# EAGLE design controler (EAGLE 6.4)
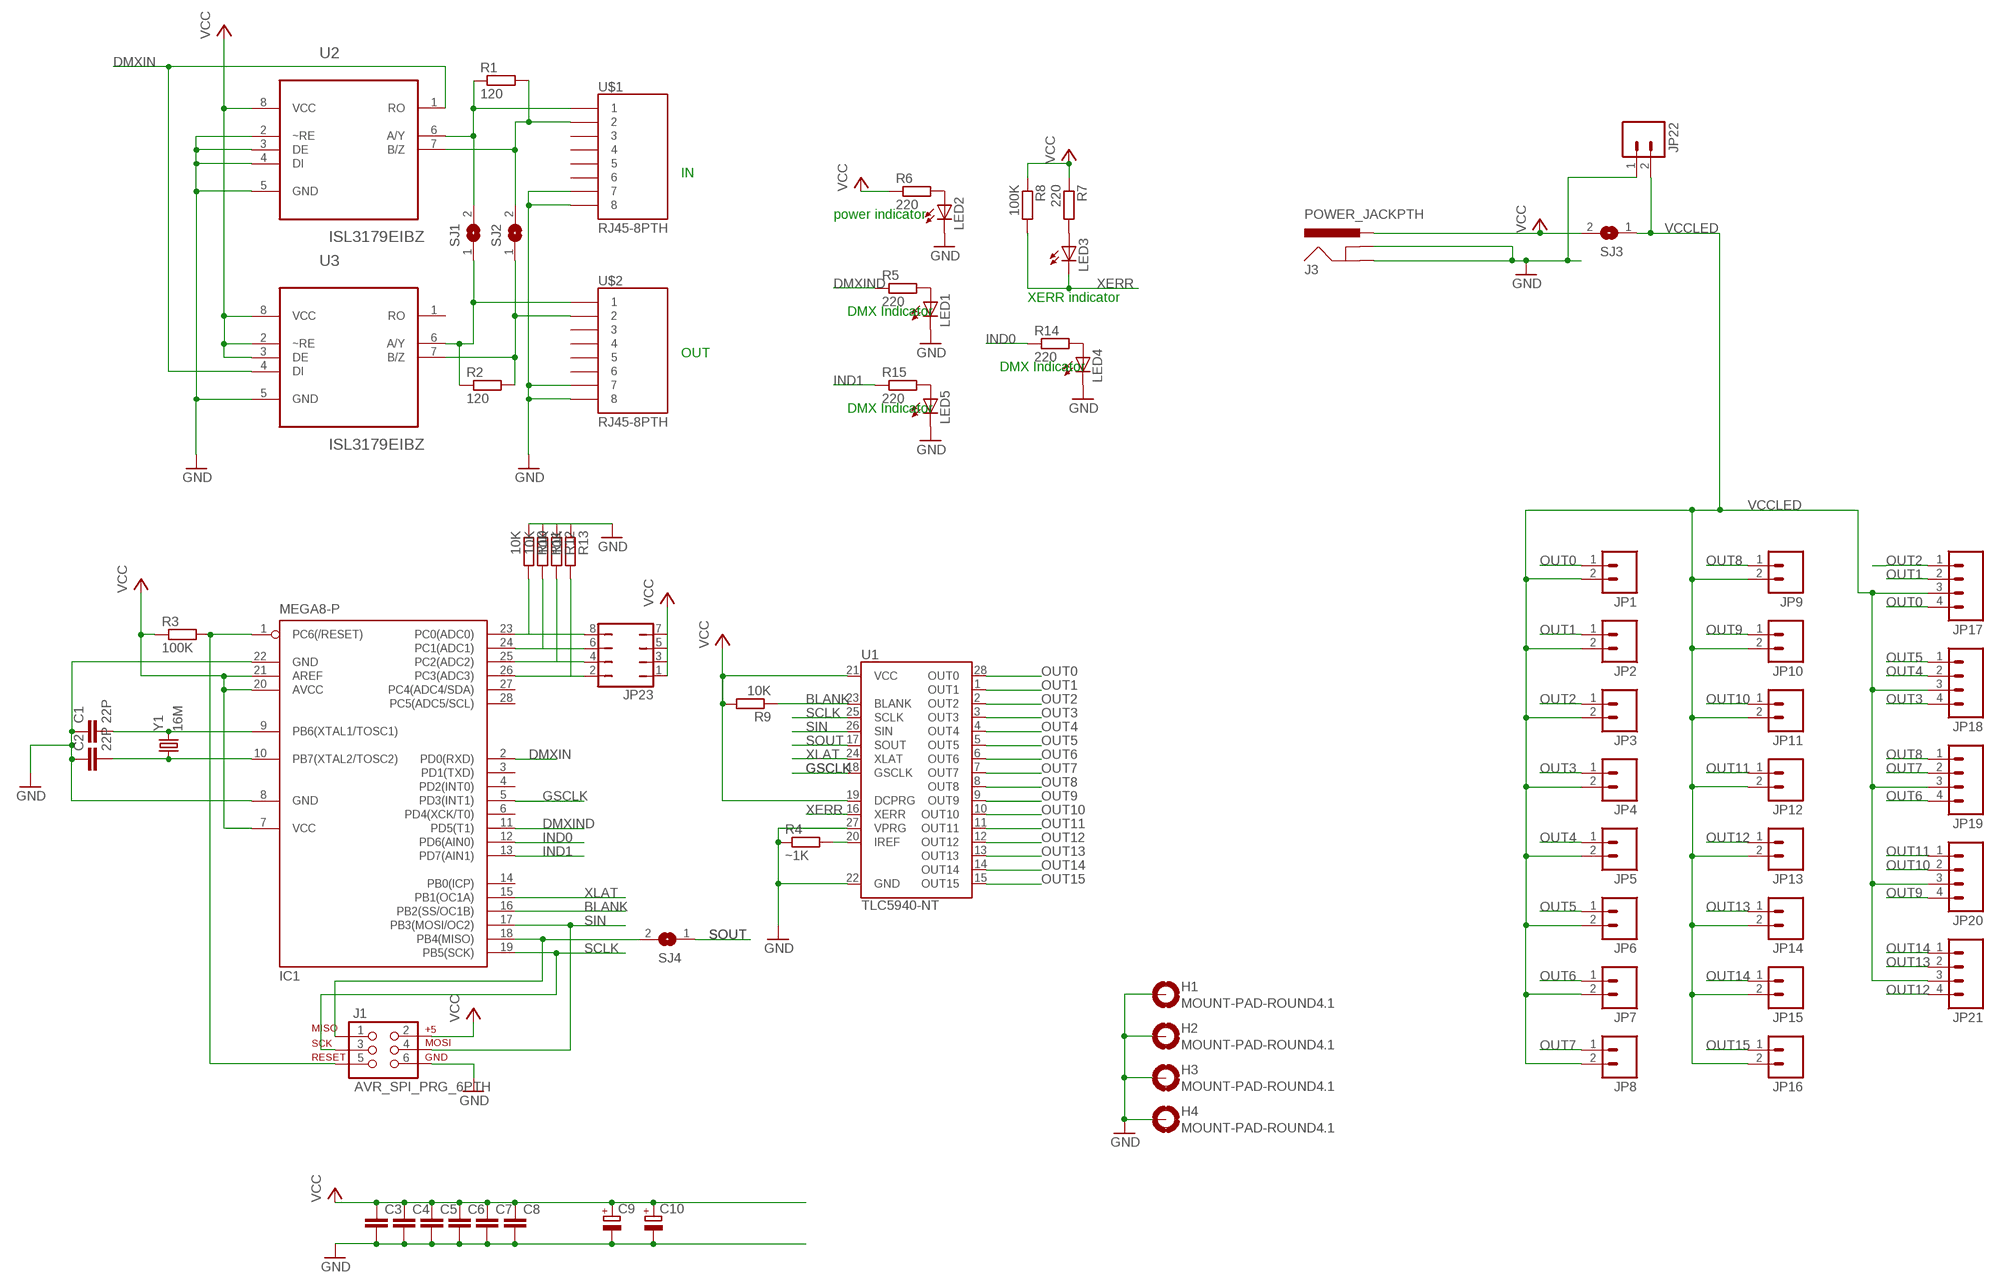
[diagram p0: schematic, sheet 1]

## Parts
C1  22P  C-EUC0603  [C0603]
C2  22P  C-EUC0603  [C0603]
C3  C-EUC0603  [C0603]
C4  C-EUC0603  [C0603]
C5  C-EUC0603  [C0603]
C6  C-EUC0603  [C0603]
C7  C-EUC0603  [C0603]
C8  C-EUC0603  [C0603]
C9  CPOL-EUE2.5-6  [E2,5-6]
C10  CPOL-EUE3.5-10  [E3,5-10]
H1  MOUNT-PAD-ROUND4.1  [4,1-PAD]
H2  MOUNT-PAD-ROUND4.1  [4,1-PAD]
H3  MOUNT-PAD-ROUND4.1  [4,1-PAD]
H4  MOUNT-PAD-ROUND4.1  [4,1-PAD]
IC1  MEGA8-P  [DIL28-3]
J1  AVR_SPI_PRG_6PTH  [2X3]
J3  POWER_JACKPTH  [POWER_JACK_PTH]
JP1  M02POLAR  [MOLEX-1X2]
JP2  M02POLAR  [MOLEX-1X2]
JP3  M02POLAR  [MOLEX-1X2]
JP4  M02POLAR  [MOLEX-1X2]
JP5  M02POLAR  [MOLEX-1X2]
JP6  M02POLAR  [MOLEX-1X2]
JP7  M02POLAR  [MOLEX-1X2]
JP8  M02POLAR  [MOLEX-1X2]
JP9  M02POLAR  [MOLEX-1X2]
JP10  M02POLAR  [MOLEX-1X2]
JP11  M02POLAR  [MOLEX-1X2]
JP12  M02POLAR  [MOLEX-1X2]
JP13  M02POLAR  [MOLEX-1X2]
JP14  M02POLAR  [MOLEX-1X2]
JP15  M02POLAR  [MOLEX-1X2]
JP16  M02POLAR  [MOLEX-1X2]
JP17  M04POLAR  [MOLEX-1X4]
JP18  M04POLAR  [MOLEX-1X4]
JP19  M04POLAR  [MOLEX-1X4]
JP20  M04POLAR  [MOLEX-1X4]
JP21  M04POLAR  [MOLEX-1X4]
JP22  M023.5MM  [SCREWTERMINAL-3.5MM-2]
JP23  JP4Q  [JP4Q]
LED1  LEDCHIPLED_0603  [CHIPLED_0603]
LED2  LEDCHIPLED_0603  [CHIPLED_0603]
LED3  LEDCHIPLED_0603  [CHIPLED_0603]
LED4  LEDCHIPLED_0603  [CHIPLED_0603]
LED5  LEDCHIPLED_0603  [CHIPLED_0603]
R1  120  R-EU_R0603  [R0603]
R2  120  R-EU_R0603  [R0603]
R3  100K  R-EU_R0603  [R0603]
R4  ~1K  R-EU_R0603  [R0603]
R5  220  R-EU_R0603  [R0603]
R6  220  R-EU_R0603  [R0603]
R7  220  R-EU_R0603  [R0603]
R8  100K  R-EU_R0603  [R0603]
R9  10K  R-EU_R0603  [R0603]
R10  10K  R-EU_R0603  [R0603]
R11  10K  R-EU_R0603  [R0603]
R12  10K  R-EU_R0603  [R0603]
R13  10K  R-EU_R0603  [R0603]
R14  220  R-EU_R0603  [R0603]
R15  220  R-EU_R0603  [R0603]
SJ1  SJ  [SJ]
SJ2  SJ  [SJ]
SJ3  SJW  [SJW]
SJ4  SJ  [SJ]
U1  TLC5940-NT  [DIL28-3]
U2  ISL3179EIBZ  [SOIC127P600X175-8N]
U3  ISL3179EIBZ  [SOIC127P600X175-8N]
U$1  RJ45-8PTH  [RJ45-8]
U$2  RJ45-8PTH  [RJ45-8]
Y1  16M  CRYSTALHC49US  [HC49US]

## Nets
BLANK: IC1.16(PB2(SS/OC1B)) R9.1 U1.23(BLANK)
DMXIN: IC1.2(PD0(RXD)) U2.1(RO) U3.4(DI)
DMXIND: IC1.11(PD5(T1)) R5.1
GND: C1.1 C2.1 C3.2 C4.2 C5.2 C6.2 C7.2 C8.2 C9.- C10.- H1.B4,1(MOUNT) H2.B4,1(MOUNT) H3.B4,1(MOUNT) H4.B4,1(MOUNT) IC1.8(GND) IC1.22(GND) J1.6 J3.GND J3.GNDBREAK JP22.1 LED1.C LED2.C LED4.C LED5.C R4.1 R10.1 R11.1 R12.1 R13.1 U1.22(GND) U1.27(VPRG) U2.2(~RE) U2.3(DE) U2.4(DI) U2.5(GND) U3.5(GND) U$1.7 U$1.8 U$2.7 U$2.8
GSCLK: IC1.5(PD3(INT1)) U1.18(GSCLK)
IND0: IC1.12(PD6(AIN0)) R14.1
IND1: IC1.13(PD7(AIN1)) R15.1
N$1: R1.1 SJ1.2 U2.6(A/Y) U$1.1
N$2: R1.2 SJ2.2 U2.7(B/Z) U$1.2
N$3: R2.1 SJ1.1 U3.6(A/Y) U$2.1
N$4: R2.2 SJ2.1 U3.7(B/Z) U$2.2
N$5: C1.2 IC1.9(PB6(XTAL1/TOSC1)) Y1.2
N$6: C2.2 IC1.10(PB7(XTAL2/TOSC2)) Y1.1
N$7: IC1.23(PC0(ADC0)) JP23.8 R10.2
N$8: IC1.24(PC1(ADC1)) JP23.6 R11.2
N$9: IC1.1(PC6(/RESET)) J1.5 R3.2
N$10: IC1.25(PC2(ADC2)) JP23.4 R12.2
N$11: IC1.18(PB4(MISO)) J1.1 SJ4.2
N$12: IC1.26(PC3(ADC3)) JP23.2 R13.2
N$13: LED5.A R15.2
N$14: R4.2 U1.20(IREF)
N$15: LED3.A R7.2
N$17: LED1.A R5.2
N$18: LED4.A R14.2
N$19: LED2.A R6.2
OUT0: JP1.1 JP17.4 U1.28(OUT0)
OUT1: JP2.1 JP17.2 U1.1(OUT1)
OUT2: JP3.1 JP17.1 U1.2(OUT2)
OUT3: JP4.1 JP18.4 U1.3(OUT3)
OUT4: JP5.1 JP18.2 U1.4(OUT4)
OUT5: JP6.1 JP18.1 U1.5(OUT5)
OUT6: JP7.1 JP19.4 U1.6(OUT6)
OUT7: JP8.1 JP19.2 U1.7(OUT7)
OUT8: JP9.1 JP19.1 U1.8(OUT8)
OUT9: JP10.1 JP20.4 U1.9(OUT9)
OUT10: JP11.1 JP20.2 U1.10(OUT10)
OUT11: JP12.1 JP20.1 U1.11(OUT11)
OUT12: JP13.1 JP21.4 U1.12(OUT12)
OUT13: JP14.1 JP21.2 U1.13(OUT13)
OUT14: JP15.1 JP21.1 U1.14(OUT14)
OUT15: JP16.1 U1.15(OUT15)
SCLK: IC1.19(PB5(SCK)) J1.3 U1.25(SCLK)
SIN: IC1.17(PB3(MOSI/OC2)) J1.4 U1.26(SIN)
SOUT: SJ4.1 U1.17(SOUT)
VCC: C3.1 C4.1 C5.1 C6.1 C7.1 C8.1 C9.+ C10.+ IC1.7(VCC) IC1.20(AVCC) IC1.21(AREF) J1.2 J3.PWR JP23.1 JP23.3 JP23.5 JP23.7 R3.1 R6.1 R7.1 R8.1 R9.2 SJ3.2 U1.19(DCPRG) U1.21(VCC) U2.8(VCC) U3.2(~RE) U3.3(DE) U3.8(VCC)
VCCLED: JP1.2 JP2.2 JP3.2 JP4.2 JP5.2 JP6.2 JP7.2 JP8.2 JP9.2 JP10.2 JP11.2 JP12.2 JP13.2 JP14.2 JP15.2 JP16.2 JP17.3 JP18.3 JP19.3 JP20.3 JP21.3 JP22.2 SJ3.1
XERR: LED3.C R8.2 U1.16(XERR)
XLAT: IC1.15(PB1(OC1A)) U1.24(XLAT)
Unconnected: IC1.3(PD1(TXD)) IC1.4(PD2(INT0)) IC1.6(PD4(XCK/T0)) IC1.14(PB0(ICP)) IC1.27(PC4(ADC4/SDA)) IC1.28(PC5(ADC5/SCL)) U3.1(RO) U$1.3 U$1.4 U$1.5 U$1.6 U$2.3 U$2.4 U$2.5 U$2.6

## Notes on the sheet
- IN
- power indicator
- XERR indicator
- DMX Indicator
- OUT
- DMX Indicator
- DMX Indicator

## Library data of the parts
C1 C2 = rcl:C-EU: CAPACITOR, European symbol
C3-C8 = resistor:C-EU: CAPACITOR, European symbol
C9 C10 = resistor:CPOL-EU: POLARIZED CAPACITOR, European symbol
H1-H4 = holes:MOUNT-PAD-ROUND: MOUNTING PAD, round
IC1 = atmel:MEGA8-P: MICROCONTROLLER 8 Kbytes FLASH, 1 kbytes SRAM, 512 bytes EEPROM, USART, 4-channel 10 bit ADC, 2-channel 8 bit ADC Pin compatible with Atmega48, ATMega88, ATMega168 Source: avr.lbr; OC_FARNELL: unknown; OC_NEWARK: unknown
J1 = SparkFun:AVR_SPI_PRG_6: AVR ISP 6 Pin This is the reduced ISP connector for AVR programming. Common on Arduino. This footprint will take up less PCB space and can be used with a 10-pin to 6-pin adapter such as SKU: BOB-08508
J3 = SparkFun:POWER_JACK: Power Jack This is the standard 5.5mm barrel jack for power. The PTH is the most common, proven, reliable, footprint. All others are experimental. The Slot footprint only works if the mill layer is transmitted to the PCB fab house so be warned. Spark Fun Electronics SKU : PRT-00119. Mating wall wart : TOL-00298 (and others)
JP1-JP16 JP22 = SparkFun:M02: Header 2 Standard 2-pin 0.1" header. Use with straight break away headers (SKU : PRT-00116), right angle break away headers (PRT-00553), swiss pins (PRT-00743), machine pins (PRT-00117), and female headers (PRT-00115). Molex polarized connector foot print use with SKU : PRT-08233 with associated crimp pins and housings.
JP17-JP21 = SparkFun:M04: Header 4 Standard 4-pin 0.1" header. Use with straight break away headers (SKU : PRT-00116), right angle break away headers (PRT-00553), swiss pins (PRT-00743), machine pins (PRT-00117), and female headers (PRT-00115). Molex polarized connector foot print use with SKU : PRT-08231 with associated crimp pins and housings. 1MM SMD Version SKU: PRT-10208
JP23 = jumper:JP4Q: JUMPER
LED1-LED5 = adafruit:LED: LED OSRAM: - CHIPLED LG R971, LG N971, LY N971, LG Q971, LY Q971, LO R971, LY R971 LH N974, LH R974 LS Q976, LO Q976, LY Q976 LO Q996 - Hyper CHIPLED LW Q18S LB Q993, LB Q99A, LB R99A - SideLED LS A670, LO A670, LY A670, LG A670, LP A670 LB A673, LV A673, LT A673, LW A673 LH A674 LY A675 LS A676, LA A676, LO A676, LY A676, LW A676 LS A679, LY A679, LG A679 - Hyper Micro SIDELED® LS Y876, LA Y876, LO Y876, LY Y876 LT Y87S - SmartLED LW L88C, LW L88S LB L89C, LB L89S, LG L890 LS L89K, LO L89K, LY L89K LS L896, LA L896, LO L896, LY L896 - TOPLED LS T670, LO T670, LY T670, LG T670, LP T670 LSG T670, LSP T670, LSY T670, LOP T670, LYG T670 LG T671, LOG T671, LSG T671 LB T673, LV T673, LT T673, LW T673 LH T674 LS T676, LA T676, LO T676, LY T676, LB T676, LH T676, LSB T676, LW T676 LB T67C, LV T67C, LT T67C, LS T67K, LO T67K, LY T67K, LW E67C LS E67B, LA E67B, LO E67B, LY E67B, LB E67C, LV E67C, LT E67C LW T67C LS T679, LY T679, LG T679 LS T770, LO T770, LY T770, LG T770, LP T770 LB T773, LV T773, LT T773, LW T773 LH T774 LS E675, LA E675, LY E675, LS T675 LS T776, LA T776, LO T776, LY T776, LB T776 LHGB T686 LT T68C, LB T68C - Hyper Mini TOPLED® LB M676 - Mini TOPLED Santana® LG M470 LS M47K, LO M47K, LY M47K Source: http://www.osram.convergy.de/
R1 R2 = rcl:R-EU_: RESISTOR, European symbol
R3-R15 = resistor:R-EU_: RESISTOR, European symbol
SJ1-SJ4 = jumper:SJ: SMD solder JUMPER
U1 = SparkFun:TLC5940: TI TLC5940 16-channel LED Driver with Dot Correction and Grayscale PWM Control The TLC5940 is a 16-channel, constant-current sink LED driver. Each channel has an individually adjustable 4096-step grayscale PWM brightness control and a 64-step, constant-current sink (dot correction). The dot correction adjusts the brightness variations between LED channels and other LED drivers. The dot correction data is stored in an integrated EEPROM. Both grayscale control and dot correction are accessible via a serial interface. A single external resistor sets the maximum current value of all 16 channels. Packages: 28-pin HTSSOP 32-pin 5x5mm QFN 28-pin DIP
U2 U3 = glacsweb:ISL3179EIBZ: TRANCEIVER; MPN: ISL3179EIBZ; OC_FARNELL: 1439860; OC_NEWARK: 58M7513; PACKAGE: SOIC-8; SUPPLIER: Intersil
U$1 U$2 = SparkFun:RJ45-8: RJ45 Jack Simple RJ45, 8-pin connection - connector for common Cat5, Cat5e, and Cat6 Ethernet cables. Footprint not yet proven in production. Connector sku is PRT-00643; Breakout PCB sku is BOB-00716.
Y1 = SparkFun:CRYSTAL: Crystals Various standard crystals. Proven footprints. Spark Fun Electronics SKU : COM-00534

## Board
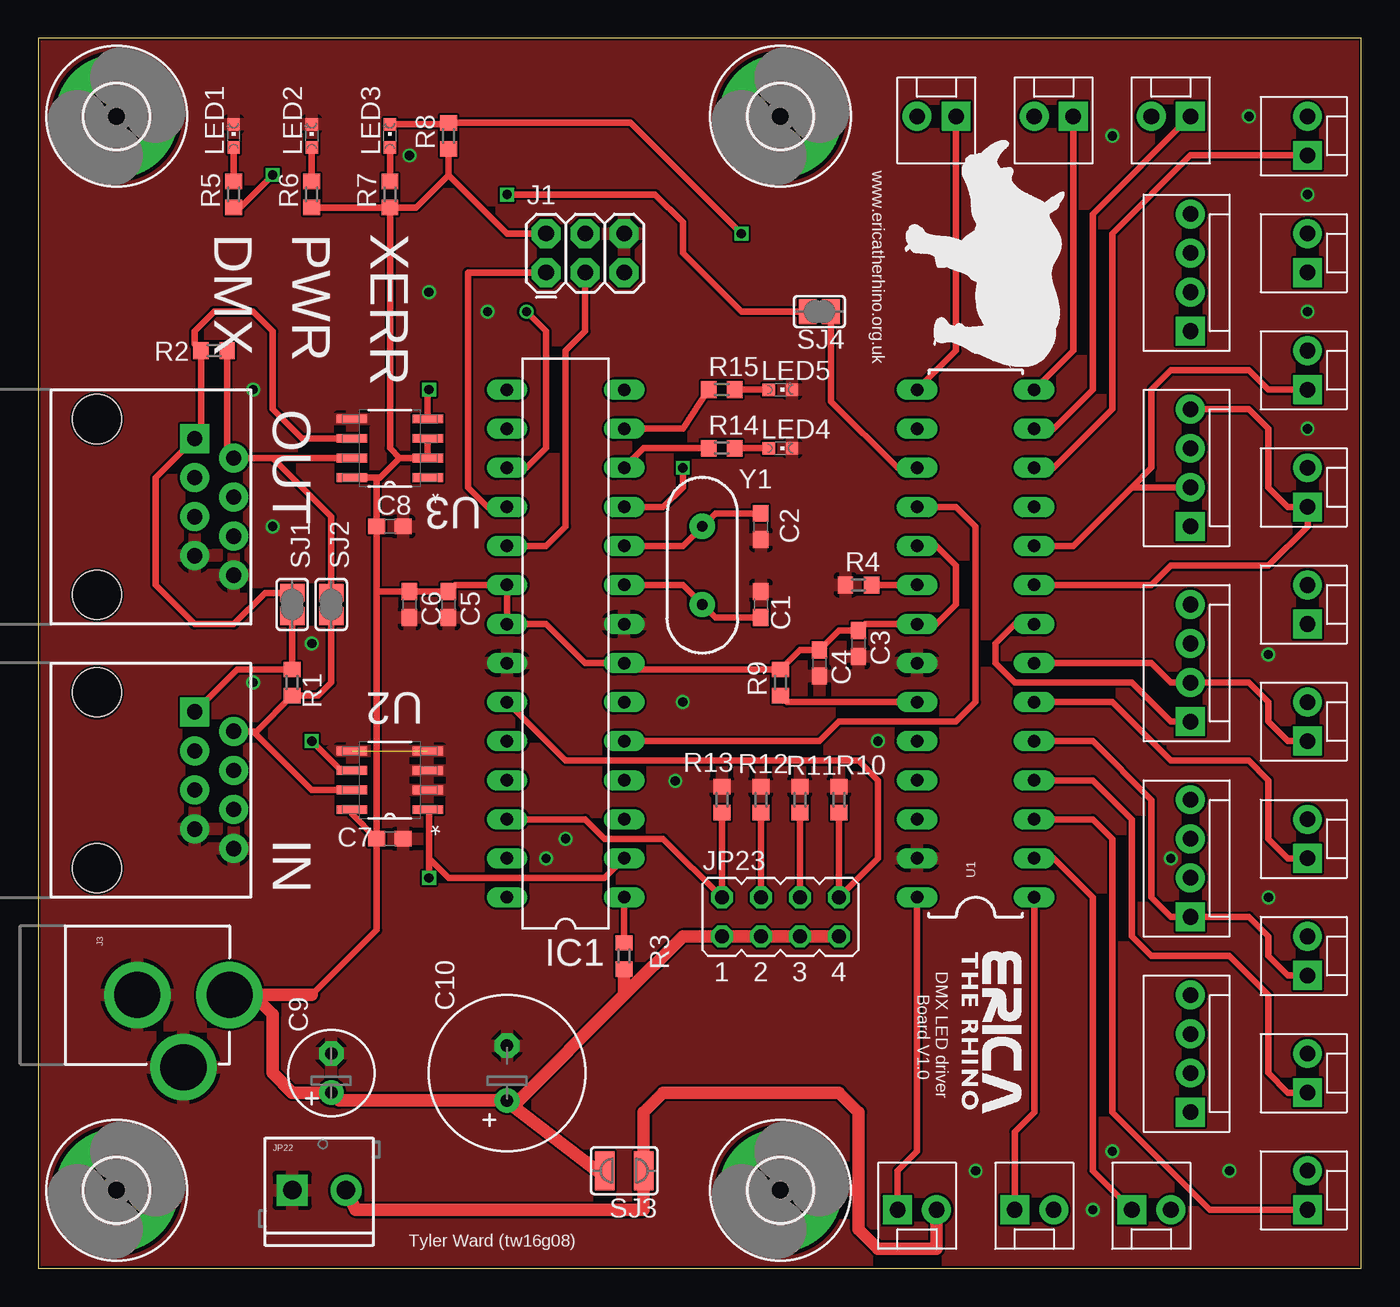
[diagram p1: board, top side]
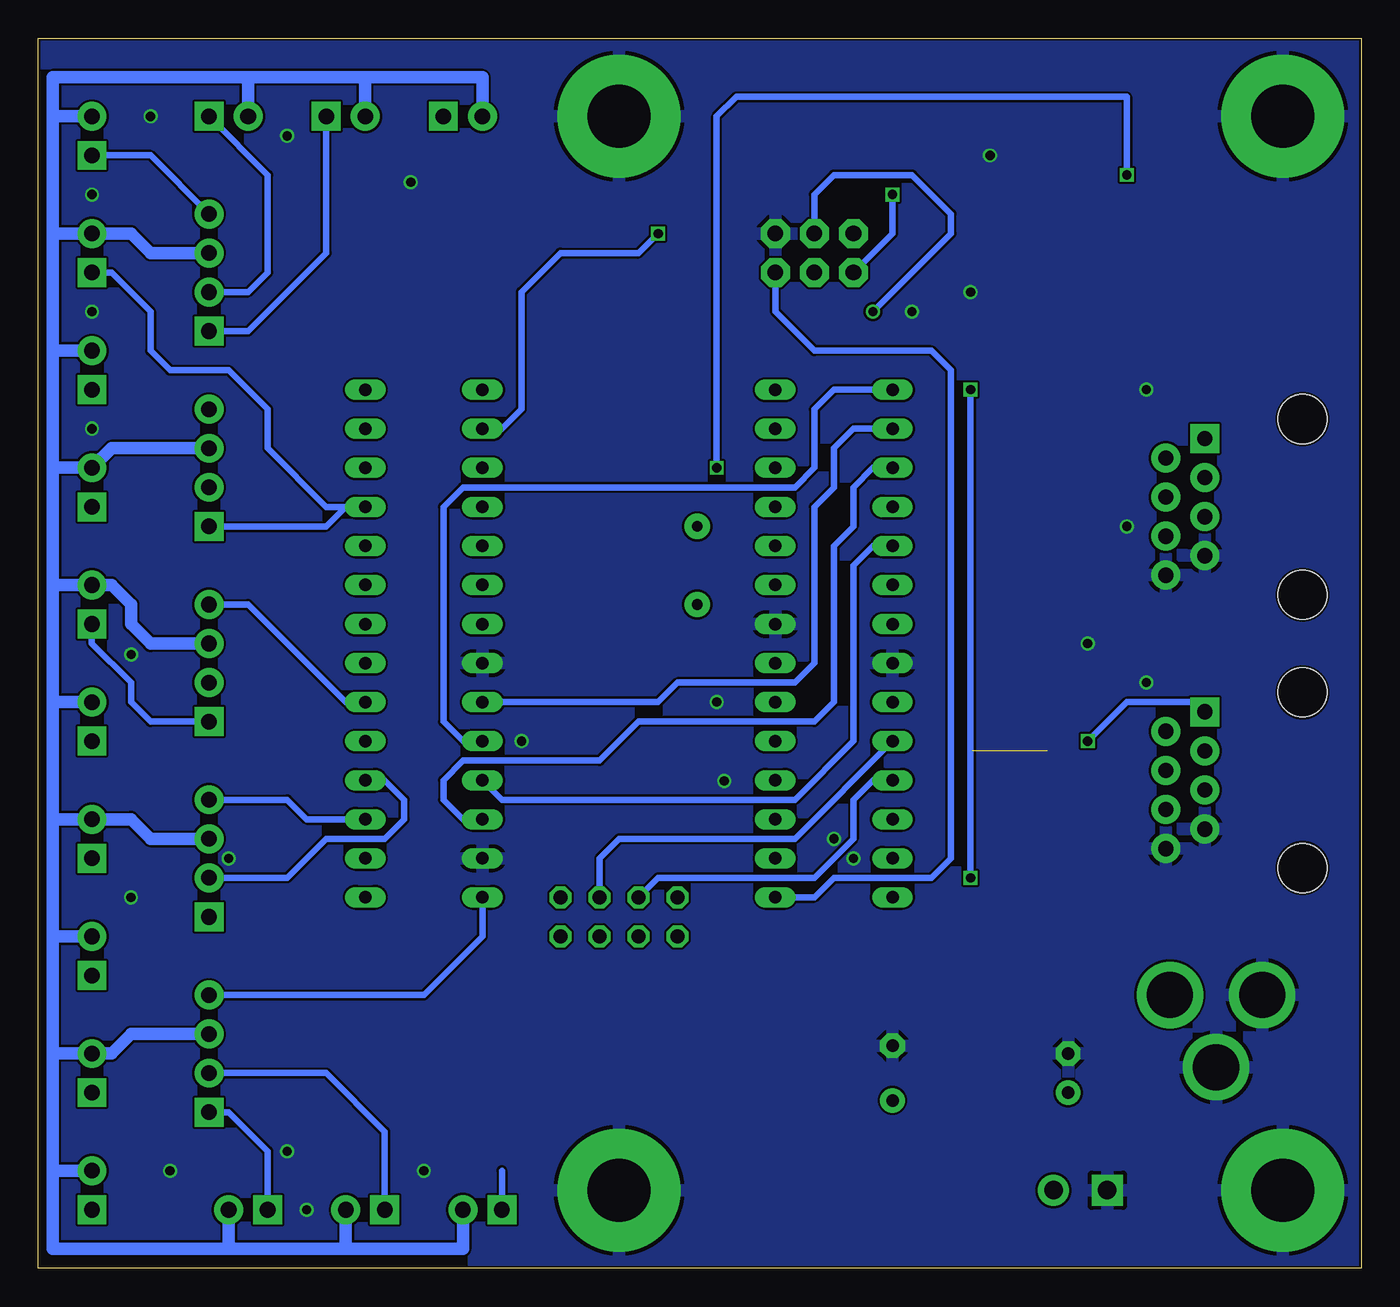
[diagram p2: board, bottom side, seen from below]

Size 86.03 x 80 mm. Coordinates in mm from the lower left corner, seen from the top.
Outline: 0,0 86.03,0 86.03,80 0,80 0,0
Copper layers (1*16): Top 0.035mm / dielectric 1.5mm / Bottom 0.035mm
Design rules "Hackvana": minimum track width 6mil, minimum drill 0.3mm, track to track 6mil, track to pad 6mil, pad to pad 6mil, via to via 6mil, smd to smd 0mil, copper to edge 6mil, drill to drill 6mil, minimum pad ring 10mil, minimum via ring 6mil, stop-mask expansion 2mil, vias tented up to drill 100mil, thermal gap 10mil

### Footprints (pad centres in the part's own frame; a part is rotated, then mirrored left to right if it is on the bottom)
C0603 = smd 1.1 x 1: 1 -0.85,0; 2 0.85,0
E2,5-6 = drill 0.813 pad 1.6: + -1.27,0 | drill 0.813 pad 1.6 octagon: - 1.27,0
E3,5-10 = drill 0.813 pad 1.6: + -1.778,0 | drill 0.813 pad 1.6 octagon: - 1.778,0
4,1-PAD = drill 4.1 pad 8: B4,1 0,0
DIL28-3 = drill 0.813 long: 1 -16.51,-3.81; 2 -13.97,-3.81; 3 -11.43,-3.81; 4 -8.89,-3.81; 5 -6.35,-3.81; 6 -3.81,-3.81; 7 -1.27,-3.81; 8 1.27,-3.81; 9 3.81,-3.81; 10 6.35,-3.81; 11 8.89,-3.81; 12 11.43,-3.81; 13 13.97,-3.81; 14 16.51,-3.81; 15 16.51,3.81; 16 13.97,3.81; 17 11.43,3.81; 18 8.89,3.81; 19 6.35,3.81; 20 3.81,3.81; 21 1.27,3.81; 22 -1.27,3.81; 23 -3.81,3.81; 24 -6.35,3.81; 25 -8.89,3.81; 26 -11.43,3.81; 27 -13.97,3.81; 28 -16.51,3.81
2X3 = drill 1.016 pad 1.88 octagon: 1 0,0; 2 0,2.54; 3 2.54,0; 4 2.54,2.54; 5 5.08,0; 6 5.08,2.54
POWER_JACK_PTH = drill 2.997 pad 4.318: GND 0,7.7; GNDBREAK 4.7,10.7; PWR 0,13.7
MOLEX-1X2 = drill 1.016 pad 1.88 square: 1 0,0 | drill 1.016 pad 1.88: 2 2.54,0
MOLEX-1X4 = drill 1.016 pad 1.88 square: 1 0,0 | drill 1.016 pad 1.88: 2 2.54,0; 3 5.08,0; 4 7.62,0
SCREWTERMINAL-3.5MM-2 = drill 1.2 pad 2.032 square: 1 0,0 | drill 1.2 pad 2.032: 2 3.5,0
JP4Q = drill 0.914 octagon: 1 -3.81,-1.27; 2 -3.81,1.27; 3 -1.27,-1.27; 4 -1.27,1.27; 5 1.27,-1.27; 6 1.27,1.27; 7 3.81,-1.27; 8 3.81,1.27
CHIPLED_0603 = smd 0.8 x 0.8: A 0,-0.75; C 0,0.75
R0603 = smd 1 x 1.1: 1 -0.85,0; 2 0.85,0
SJ = smd 1.168 x 1.6: 1 -0.762,0; 2 0.762,0
SJW = smd 1.27 x 2.54: 1 -1.27,0; 2 1.27,0
SOIC127P600X175-8N = smd 1.981 x 0.559: 1 -2.464,1.905; 2 -2.464,0.635; 3 -2.464,-0.635; 4 -2.464,-1.905; 5 2.464,-1.905; 6 2.464,-0.635; 7 2.464,0.635; 8 2.464,1.905
RJ45-8 = drill 1 pad 1.88 square: 1 -4.445,6.35 | drill 1 pad 1.88: 2 -3.175,8.89; 3 -1.905,6.35; 4 -0.635,8.89; 5 0.635,6.35; 6 1.905,8.89; 7 3.175,6.35; 8 4.445,8.89 | hole 3.2: -5.715,0; 5.715,0
HC49US = drill 0.7 pad 1.651: 1 -2.54,0; 2 2.54,0

### Placement (x,y rotation side)
C1  46.99,43.18 270 top
C2  46.99,48.26 90 top
C3  53.34,40.64 270 top
C4  50.8,39.37 270 top
C5  26.67,43.18 270 top
C6  24.13,43.18 270 top
C7  22.86,27.94 0 top
C8  22.86,48.26 0 top
C9  19.05,12.7 90 top
C10  30.48,12.7 90 top
H1  5.08,5.08 0 top
H2  48.26,5.08 0 top
H3  48.26,74.93 0 top
H4  5.08,74.93 0 top
IC1  34.29,40.64 90 top
J1  33.02,64.77 0 top
J3  -1.27,17.78 270 top
JP1  55.88,3.81 0 top
JP2  63.5,3.81 0 top
JP3  71.12,3.81 0 top
JP4  82.55,3.81 90 top
JP5  82.55,11.43 90 top
JP6  82.55,19.05 90 top
JP7  82.55,26.67 90 top
JP8  82.55,34.29 90 top
JP9  82.55,41.91 90 top
JP10  82.55,49.53 90 top
JP11  82.55,57.15 90 top
JP12  82.55,64.77 90 top
JP13  82.55,72.39 90 top
JP14  74.93,74.93 180 top
JP15  67.31,74.93 180 top
JP16  59.69,74.93 180 top
JP17  74.93,10.16 90 top
JP18  74.93,22.86 90 top
JP19  74.93,35.56 90 top
JP20  74.93,48.26 90 top
JP21  74.93,60.96 90 top
JP22  16.51,5.08 0 top
JP23  48.26,22.86 0 top
LED1  12.7,73.66 0 top
LED2  17.78,73.66 0 top
LED3  22.86,73.66 0 top
LED4  48.26,53.34 270 top
LED5  48.26,57.15 270 top
R1  16.51,38.1 270 top
R2  11.43,59.69 0 top
R3  38.1,20.32 90 top
R4  53.34,44.45 0 top
R5  12.7,69.85 90 top
R6  17.78,69.85 90 top
R7  22.86,69.85 90 top
R8  26.67,73.66 90 top
R9  48.26,38.1 90 top
R10  52.07,30.48 270 top
R11  49.53,30.48 270 top
R12  46.99,30.48 270 top
R13  44.45,30.48 270 top
R14  44.45,53.34 0 top
R15  44.45,57.15 0 top
SJ1  16.51,43.18 270 top
SJ2  19.05,43.18 270 top
SJ3  38.1,6.35 180 top
SJ4  50.8,62.23 180 top
U1  60.96,40.64 90 top
U2  22.86,31.75 180 top
U3  22.86,53.34 180 top
U$1  3.81,31.75 270 top
U$2  3.81,49.53 270 top
Y1  43.18,45.72 270 top

### Tracks (layer width: path | path; a pad name or v marks a point on that pad's centre or on a via)
BLANK
  Top 0.406: U1.23 48.68,36.83 R9.1
  Bottom 0.406: IC1.16 33.02,54.61 34.29,53.34 34.29,50.8 35.56,49.53 35.56,39.37 36.83,38.1 44.45,38.1 45.72,36.83 U1.23
DMXIN  (via drill 0.6)
  Top 0.406: U3.4 25.32,57.07 v25.4,57.15 | v25.4,25.4 25.4,26.67 | 25.4,26.67 25.4,29.77 U2.1 | IC1.2 36.83,25.4 26.67,25.4 25.4,26.67
  Bottom 0.406: v25.4,57.15 v25.4,25.4
DMXIND  (via drill 0.6)
  Top 0.406: IC1.11 40.64,49.53 41.91,50.8 v41.91,52.07 | R5.1 13.12,69 v15.24,71.12
  Bottom 0.406: v41.91,52.07 41.91,74.93 40.64,76.2 15.24,76.2 v15.24,71.12
GND  (via drill 0.6)  (1 unrouted)
  other vias: 41.42,31.7 15.24,48.26 60.96,6.35 25.4,63.5 61.81,70.65 78.74,74.93 82.55,69.85 68.58,3.81 77.47,6.35 80.01,24.13 29.21,62.23 13.97,57.15 17.78,40.64 13.97,38.1 41.91,36.83 82.55,54.61 69.85,73.66 82.55,62.23 73.66,26.67 54.61,34.29 33.02,26.67 34.29,27.94 69.85,7.62 24.13,72.39 79.99,39.93
  pour Bottom: 0,80.01 86.36,80.01 86.36,-3.81 0,-3.81
  pour Top: 0,80.01 86.36,80.01 86.36,-6.35 0,-6.35
GSCLK
  Top 0.406: IC1.5 50.8,34.29 52.07,35.56 59.69,35.56 60.96,36.83 60.96,48.26 59.69,49.53 U1.18
IND0
  Top 0.406: R14.1 39.37,53.34 IC1.12
IND1
  Top 0.406: R15.1 41.91,54.61 IC1.13
N$1  (via drill 0.6)
  Top 0.406: U$1.1 12.92,38.95 R1.1 SJ1.2 | v17.78,34.29 19.69,32.38 U2.6
  Bottom 0.406: U$1.1 10.79,36.83 15.24,36.83 v17.78,34.29
N$2
  Top 0.406: U$1.2 13.97,34.92 | 13.97,34.92 14.19,34.92 R1.2 18.2,37.25 19.05,38.1 SJ2.2 | U2.7 17.78,31.11 13.97,34.92
N$3
  Top 0.406: SJ1.1 14.73,43.94 12.7,41.91 10.16,41.91 7.62,44.45 7.62,51.44 U$2.1 10.58,54.4 R2.1 10.16,60.11 10.16,60.96 11.43,62.23 13.97,62.23 15.24,60.96 15.24,55.88 17.14,53.98 U3.6
N$4
  Top 0.406: R2.2 12.28,53.12 U$2.2 15.24,52.7 | U3.7 15.24,52.7 | SJ2.1 19.05,48.9 15.24,52.7
N$5
  Top 0.406: IC1.9 41.91,44.45 Y1.2 44.03,42.33 C1.2
N$6
  Top 0.406: IC1.10 41.91,46.99 Y1.1 44.03,49.11 C2.2
N$7
  Top 0.406: IC1.23 34.29,33.02 53.34,33.02 54.61,31.75 54.61,26.67 JP23.8 R10.2
N$8
  Top 0.406: R11.2 JP23.6
  Bottom 0.406: IC1.24 36.83,27.94 48.26,27.94 49.53,26.67 JP23.6
N$9
  Top 0.406: IC1.1 R3.2
  Bottom 0.406: IC1.1 35.56,24.13 34.29,25.4 27.94,25.4 26.67,26.67 26.67,58.42 27.94,59.69 35.56,59.69 38.1,62.23 J1.5
N$10
  Top 0.406: R12.2 JP23.4
  Bottom 0.406: IC1.25 31.75,31.75 33.02,30.48 33.02,27.94 35.56,25.4 45.72,25.4 JP23.4
N$11  (via drill 0.6)
  Top 0.406: IC1.18 29.21,49.53 27.94,50.8 27.94,64.77 J1.1 | SJ4.2 45.72,62.23 41.91,66.04 41.91,68.05 40.11,69.85 v30.48,69.85
  Bottom 0.406: v30.48,69.85 30.48,67.31 J1.1
N$12
  Top 0.406: IC1.26 35.56,29.21 36.83,27.94 40.64,27.94 JP23.2 R13.2
N$13
  Top 0.406: R15.2 LED5.A
N$14
  Top 0.406: R4.2 U1.20
N$15
  Top 0.406: R7.2 LED3.A
N$17
  Top 0.406: R5.2 LED1.A
N$18
  Top 0.406: R14.2 LED4.A
N$19
  Top 0.406: R6.2 LED2.A
OUT0
  Top 0.406: U1.28 57.15,7.62 55.88,6.35 JP1.1
  Bottom 0.406: 55.88,6.35 JP1.1 | JP17.4 60.96,17.78 57.15,21.59 U1.28
OUT1
  Top 0.406: U1.1 64.77,10.16 63.5,8.89 JP2.1
  Bottom 0.406: JP17.2 67.31,12.7 63.5,8.89 JP2.1
OUT2
  Top 0.406: U1.2 66.04,26.67 68.58,24.13 68.58,6.35 JP3.1
  Bottom 0.406: JP17.1 73.66,10.16 71.12,7.62 JP3.1
OUT3
  Top 0.406: U1.3 68.58,29.21 69.85,27.94 69.85,10.16 76.2,3.81 JP4.1
  Bottom 0.406: JP18.4 69.85,30.48 68.58,29.21 U1.3
OUT4
  Top 0.406: U1.4 68.58,31.75 71.12,29.21 71.12,21.59 72.39,20.32 77.47,20.32 80.01,17.78 80.01,12.7 81.28,11.43 JP5.1
  Bottom 0.406: U1.4 63.5,31.75 62.23,30.48 62.23,29.21 63.5,27.94 67.31,27.94 69.85,25.4 JP18.2
OUT5
  Top 0.406: JP6.1 81.28,19.05 80.01,20.32 80.01,21.59 78.74,22.86 JP18.1 73.66,22.86 72.39,24.13 72.39,30.48 68.58,34.29 U1.5
OUT6
  Top 0.406: U1.6 69.85,36.83 73.66,33.02 78.74,33.02 80.01,31.75 80.01,27.94 81.28,26.67 JP7.1
  Bottom 0.406: JP19.4 72.39,43.18 66.04,36.83 U1.6
OUT7
  Top 0.406: U1.7 72.39,39.37 73.66,38.1 JP19.2 78.74,38.1 80.01,36.83 80.01,35.56 81.28,34.29 JP8.1
OUT8
  Top 0.406: JP19.1 73.66,35.56 71.12,38.1 63.5,38.1 62.23,39.37 62.23,40.64 63.5,41.91 U1.8
  Bottom 0.406: JP19.1 78.74,35.56 80.01,36.83 80.01,38.1 82.55,40.64 JP9.1
OUT9
  Top 0.406: JP20.4 78.74,55.88 80.01,54.61 80.01,50.8 81.28,49.53 JP10.1 82.55,48.26 80.01,45.72 73.66,45.72 72.39,44.45 U1.9
OUT10
  Top 0.406: U1.10 67.31,46.99 71.12,50.8 | 71.12,50.8 72.39,52.07 72.39,57.15 73.66,58.42 78.74,58.42 80.01,57.15 JP11.1 | JP20.2 71.12,50.8
OUT11
  Bottom 0.406: JP20.1 67.31,48.26 66.04,49.53 U1.11 67.31,49.53 71.12,53.34 71.12,55.88 73.66,58.42 77.47,58.42 78.74,59.69 78.74,62.23 81.28,64.77 JP12.1
OUT12
  Top 0.406: U1.12 66.04,52.07 69.85,55.88 69.85,67.31 74.93,72.39 JP13.1
  Bottom 0.406: JP21.4 78.74,72.39 JP13.1
OUT13
  Top 0.406: U1.13 66.04,54.61 68.58,57.15 68.58,68.58 JP14.1
  Bottom 0.406: JP21.2 72.39,63.5 71.12,64.77 71.12,71.12 JP14.1
OUT14
  Top 0.406: U1.14 67.31,59.69 JP15.1
  Bottom 0.406: JP21.1 72.39,60.96 67.31,66.04 JP15.1
OUT15
  Top 0.406: U1.15 59.69,59.69 JP16.1
SCLK
  Top 0.406: IC1.19 33.02,46.99 34.29,48.26 34.29,59.69 35.56,60.96 J1.3
  Bottom 0.406: IC1.19 31.75,46.99 33.02,45.72 33.02,34.29 36.83,30.48 55.88,30.48 U1.25
SIN  (via drill 0.6)
  Top 0.406: IC1.17 31.75,52.07 33.02,53.34 33.02,60.96 v31.75,62.23
  Bottom 0.406: IC1.17 31.75,52.07 33.02,50.8 33.02,48.26 34.29,46.99 34.29,36.83 35.56,35.56 46.99,35.56 49.53,33.02 58.42,33.02 59.69,31.75 59.69,30.48 58.42,29.21 U1.26 | v31.75,62.23 26.67,67.31 26.67,68.58 29.21,71.12 34.29,71.12 35.56,69.85 J1.4
SOUT
  Top 0.406: U1.17 55.88,52.07 51.56,56.39 SJ4.1
VCC
  Top 0.406: U1.19 58.42,46.99 59.69,45.72 59.69,43.18 58.42,41.91 U1.21 53.76,41.91 C3.1 52.07,41.49 C4.1 49.53,40.22 R9.2 38.52,38.95 IC1.7 35.56,39.37 33.02,41.91 IC1.21 IC1.20 27.09,44.45 C5.1 C6.1 22.01,44.03 | R6.1 R7.1 23.28,69 | 26.67,71.12 24.55,69 23.28,69 | 26.67,71.12 R8.1 | J1.2 30.48,67.31 26.67,71.12 | 23.5,52.7 22.23,51.44 U3.8 22.01,51.44 C8.1 22.01,44.03 | 23.5,52.7 U3.2 U3.3 | U2.8 20.4,29.55 C7.1 | C7.1 22.01,44.03 | 17.78,17.78 22.01,22.01 C7.1 | 23.28,69 22.86,68.58 22.86,53.34 23.5,52.7
  Top 0.813: SJ3.2 36.32,6.35 30.86,10.54 | 30.86,10.54 C10.+ 19.56,10.92 C9.+ 16.51,11.43 15.24,12.7 15.24,16.51 13.97,17.78 | R3.1 38.1,17.78 | 38.1,17.78 30.86,10.54 | 13.97,17.78 J3.PWR | 17.78,17.78 13.97,17.78 | 38.1,17.78 41.91,21.59 JP23.1 JP23.3 JP23.5 JP23.7
VCCLED
  Top 0.813: JP1.2 58.42,1.27 54.61,1.27 53.34,2.54 53.34,10.16 52.07,11.43 40.64,11.43 39.37,10.16 SJ3.1 39.37,3.81 20.63,3.81 JP22.2
  Bottom 0.813: JP1.2 58.42,1.27 66.04,1.27 | JP2.2 66.04,1.27 | 66.04,1.27 73.66,1.27 | JP3.2 73.66,1.27 | 73.66,1.27 85.09,1.27 85.09,6.35 | JP4.2 85.09,6.35 | 85.09,6.35 85.09,13.97 | 85.09,13.97 JP5.2 81.28,13.97 80.01,15.24 JP17.3 | 85.09,13.97 85.09,21.59 | 85.09,21.59 JP6.2 | 85.09,29.21 JP7.2 80.01,29.21 78.74,27.94 JP18.3 | 85.09,29.21 85.09,21.59 | JP8.2 85.09,36.83 | 85.09,36.83 85.09,29.21 | 85.09,44.45 JP9.2 81.28,44.45 80.01,43.18 80.01,41.91 78.74,40.64 JP19.3 | 85.09,44.45 85.09,36.83 | 85.09,52.07 JP10.2 81.28,53.34 JP20.3 | 85.09,52.07 85.09,44.45 | JP11.2 85.09,59.69 | 85.09,59.69 85.09,52.07 | 85.09,67.31 JP12.2 80.01,67.31 78.74,66.04 JP21.3 | 85.09,67.31 85.09,59.69 | JP13.2 85.09,74.93 | 85.09,74.93 85.09,67.31 | JP14.2 72.39,77.47 | 72.39,77.47 85.09,77.47 85.09,74.93 | JP15.2 64.77,77.47 | 64.77,77.47 72.39,77.47 | JP16.2 57.15,77.47 64.77,77.47
XERR  (via drill 0.6)
  Top 0.406: v45.72,67.31 38.52,74.51 R8.2 26.57,74.41 LED3.C
  Bottom 0.406: U1.16 55.88,54.61 54.61,55.88 54.61,63.5 52.07,66.04 46.99,66.04 v45.72,67.31
XLAT
  Bottom 0.406: IC1.15 34.29,57.15 35.56,55.88 35.56,52.07 36.83,50.8 58.42,50.8 59.69,49.53 59.69,35.56 58.42,34.29 U1.24
(copper drawn outside any net)
  shapes: Top area x1107

### Text on the board
tSilk: C:/Users/Tyler/Downloads/C-Profile.bmp | www.ericatherhino.org.uk | DMX LED driver / Board V1.0 | Tyler Ward (tw16g08)
_tsilk: DMX | PWR | XERR | OUT | IN